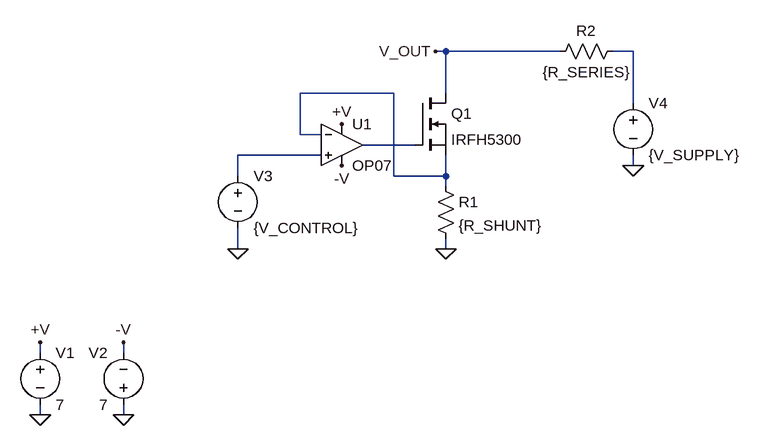
[diagram p0: schematic DummyLoadGeneral.asc]
DummyLoadGeneral.asc, the LTspice schematic file:
Version 4
SHEET 1 880 680
WIRE 352 32 336 32
WIRE 528 32 352 32
WIRE 640 32 608 32
WIRE 272 96 128 96
WIRE 352 96 352 32
WIRE 640 112 640 32
WIRE 128 160 128 96
WIRE 160 160 128 160
WIRE 304 176 224 176
WIRE 160 192 32 192
WIRE 640 208 640 192
WIRE 32 224 32 192
WIRE 272 224 272 96
WIRE 352 224 352 192
WIRE 352 224 272 224
WIRE 352 240 352 224
WIRE 32 336 32 304
WIRE 352 336 352 320
WIRE -272 496 -272 480
WIRE -144 496 -144 480
WIRE -272 592 -272 576
WIRE -144 592 -144 576
FLAG -272 592 0
FLAG -144 592 0
FLAG -272 480 +V
FLAG -144 480 -V
FLAG 192 144 +V
FLAG 192 208 -V
FLAG 32 336 0
FLAG 352 336 0
FLAG 640 208 0
FLAG 336 32 V_OUT
SYMBOL Opamps\\OP07 192 112 R0
SYMATTR InstName U1
SYMBOL voltage -272 480 R0
WINDOW 123 0 0 Left 2
WINDOW 39 0 0 Left 2
SYMATTR InstName V1
SYMATTR Value 7
SYMBOL voltage -144 592 R180
WINDOW 0 24 96 Left 2
WINDOW 3 24 16 Left 2
WINDOW 123 0 0 Left 2
WINDOW 39 0 0 Left 2
SYMATTR InstName V2
SYMATTR Value 7
SYMBOL voltage 32 208 R0
WINDOW 123 0 0 Left 2
WINDOW 39 0 0 Left 2
SYMATTR InstName V3
SYMATTR Value {V_CONTROL}
SYMBOL res 336 224 R0
SYMATTR InstName R1
SYMATTR Value {R_SHUNT}
SYMBOL nmos 304 96 R0
SYMATTR InstName Q1
SYMATTR Value IRFH5300
SYMBOL voltage 640 96 R0
WINDOW 123 0 0 Left 2
WINDOW 39 0 0 Left 2
SYMATTR InstName V4
SYMATTR Value {V_SUPPLY}
SYMBOL res 624 16 R90
WINDOW 0 0 56 VBottom 2
WINDOW 3 32 56 VTop 2
SYMATTR InstName R2
SYMATTR Value {R_SERIES}

The netlist it stands for:
* DummyLoadGeneral.asc
XU1 N004 N002 +V -V N003 LT1001  ; OP07, pins In+ In- V+ V- OUT
V1 +V 0 7
V2 0 -V 7
V3 N004 0 {V_CONTROL}
R1 N002 0 {R_SHUNT}
M§Q1 V_OUT N003 N002 N002 IRFH5300
V4 N001 0 {V_SUPPLY}
R2 N001 V_OUT {R_SERIES}
.model NMOS NMOS
.model PMOS PMOS
.lib standard.mos
.lib LTC.lib
.backanno
.end